# Altium schematic sheet POWER_ISOLATE_AND_LDO.SchDoc
size 420 x 297 mm; SheetNumber: 3; SheetTotal: 5
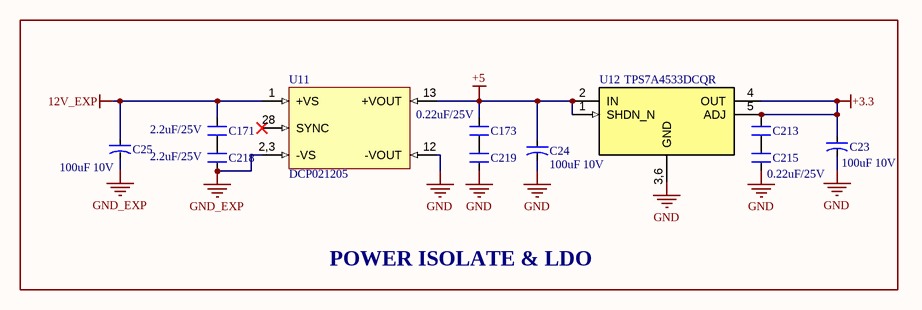
[diagram p0: POWER_ISOLATE_AND_LDO.SchDoc]

## Parts
C23  100uF 10V  [CAP_TANT_1206]
C24  100uF 10V  [CAP_TANT_1206]
C25  100uF 10V  [CAP_TANT_1206]
C171  2.2uF/25V  [SM-0603]
C173  0.22uF/25V  [SM-0603]
C213  0.22uF/25V  [SM-0603]  (value not drawn)
C215  0.22uF/25V  [SM-0603]
C218  2.2uF/25V  [SM-0603]
C219  0.22uF/25V  [SM-0603]  (value not drawn)
U11  DCP021205  [DCP02]
U12  TPS7A4533DCQR  [SOT223-6]

## Blocks framed on the sheet
POWER ISOLATE & LDO: C23-C25 C171 C173 C213 C215 C218 C219 U11 U12

## Nets
12V_EXP: C25.1 C171.2 U11.1(+VS)
+3.3: C23.1 C213.2 U12.4(OUT) U12.5(ADJ)
+5: C24.1 C173.2 U11.13(+VOUT) U12.1(SHDN_N) U12.2(IN)
GND: C23.2 C24.2 C215.1 C219.1 U11.12(-VOUT) U12.3,6(GND)
GND_EXP: C25.2 C218.1 U11.2,3(-VS)
NetC171_1: C171.1 C218.2
NetC173_1: C173.1 C219.2
NetC213_1: C213.1 C215.2

Not connected (* = marked no-connect by the designer): U11 28(SYNC)*

## Notes on the sheet
- Project:
- BEE-PC1
- Sub-system:
- Design by:
- Hung Nguyen D.
- Bao Bui Q.
- Sheet title:
- Sheet
- A3
- of
- Checked by:
- Approved by:
- Vu Pham
- Revision:
- Document No:
- V1.0.0
- Size:
- Date:

## Library data of the parts
C23-C25 = CN-ALU-SMD: Polarized Capacitor (Axial); Published: 8-Jun-2000; LatestRevisionDate: 17-Jul-2002; LatestRevisionNote: Re-released for DXP Platform.; PackageReference: POLAR0.8; Publisher: Altium Limited
C171 C173 C213 C215 C218 C219 = CM: 0603; Value: 103
U11 = PWR_ISO_DCP02
U12 = TPS7A4533DCQR: IC REG LINEAR 3.3V 1.5A SOT223-6